# Altium project SDC.PrjPcb
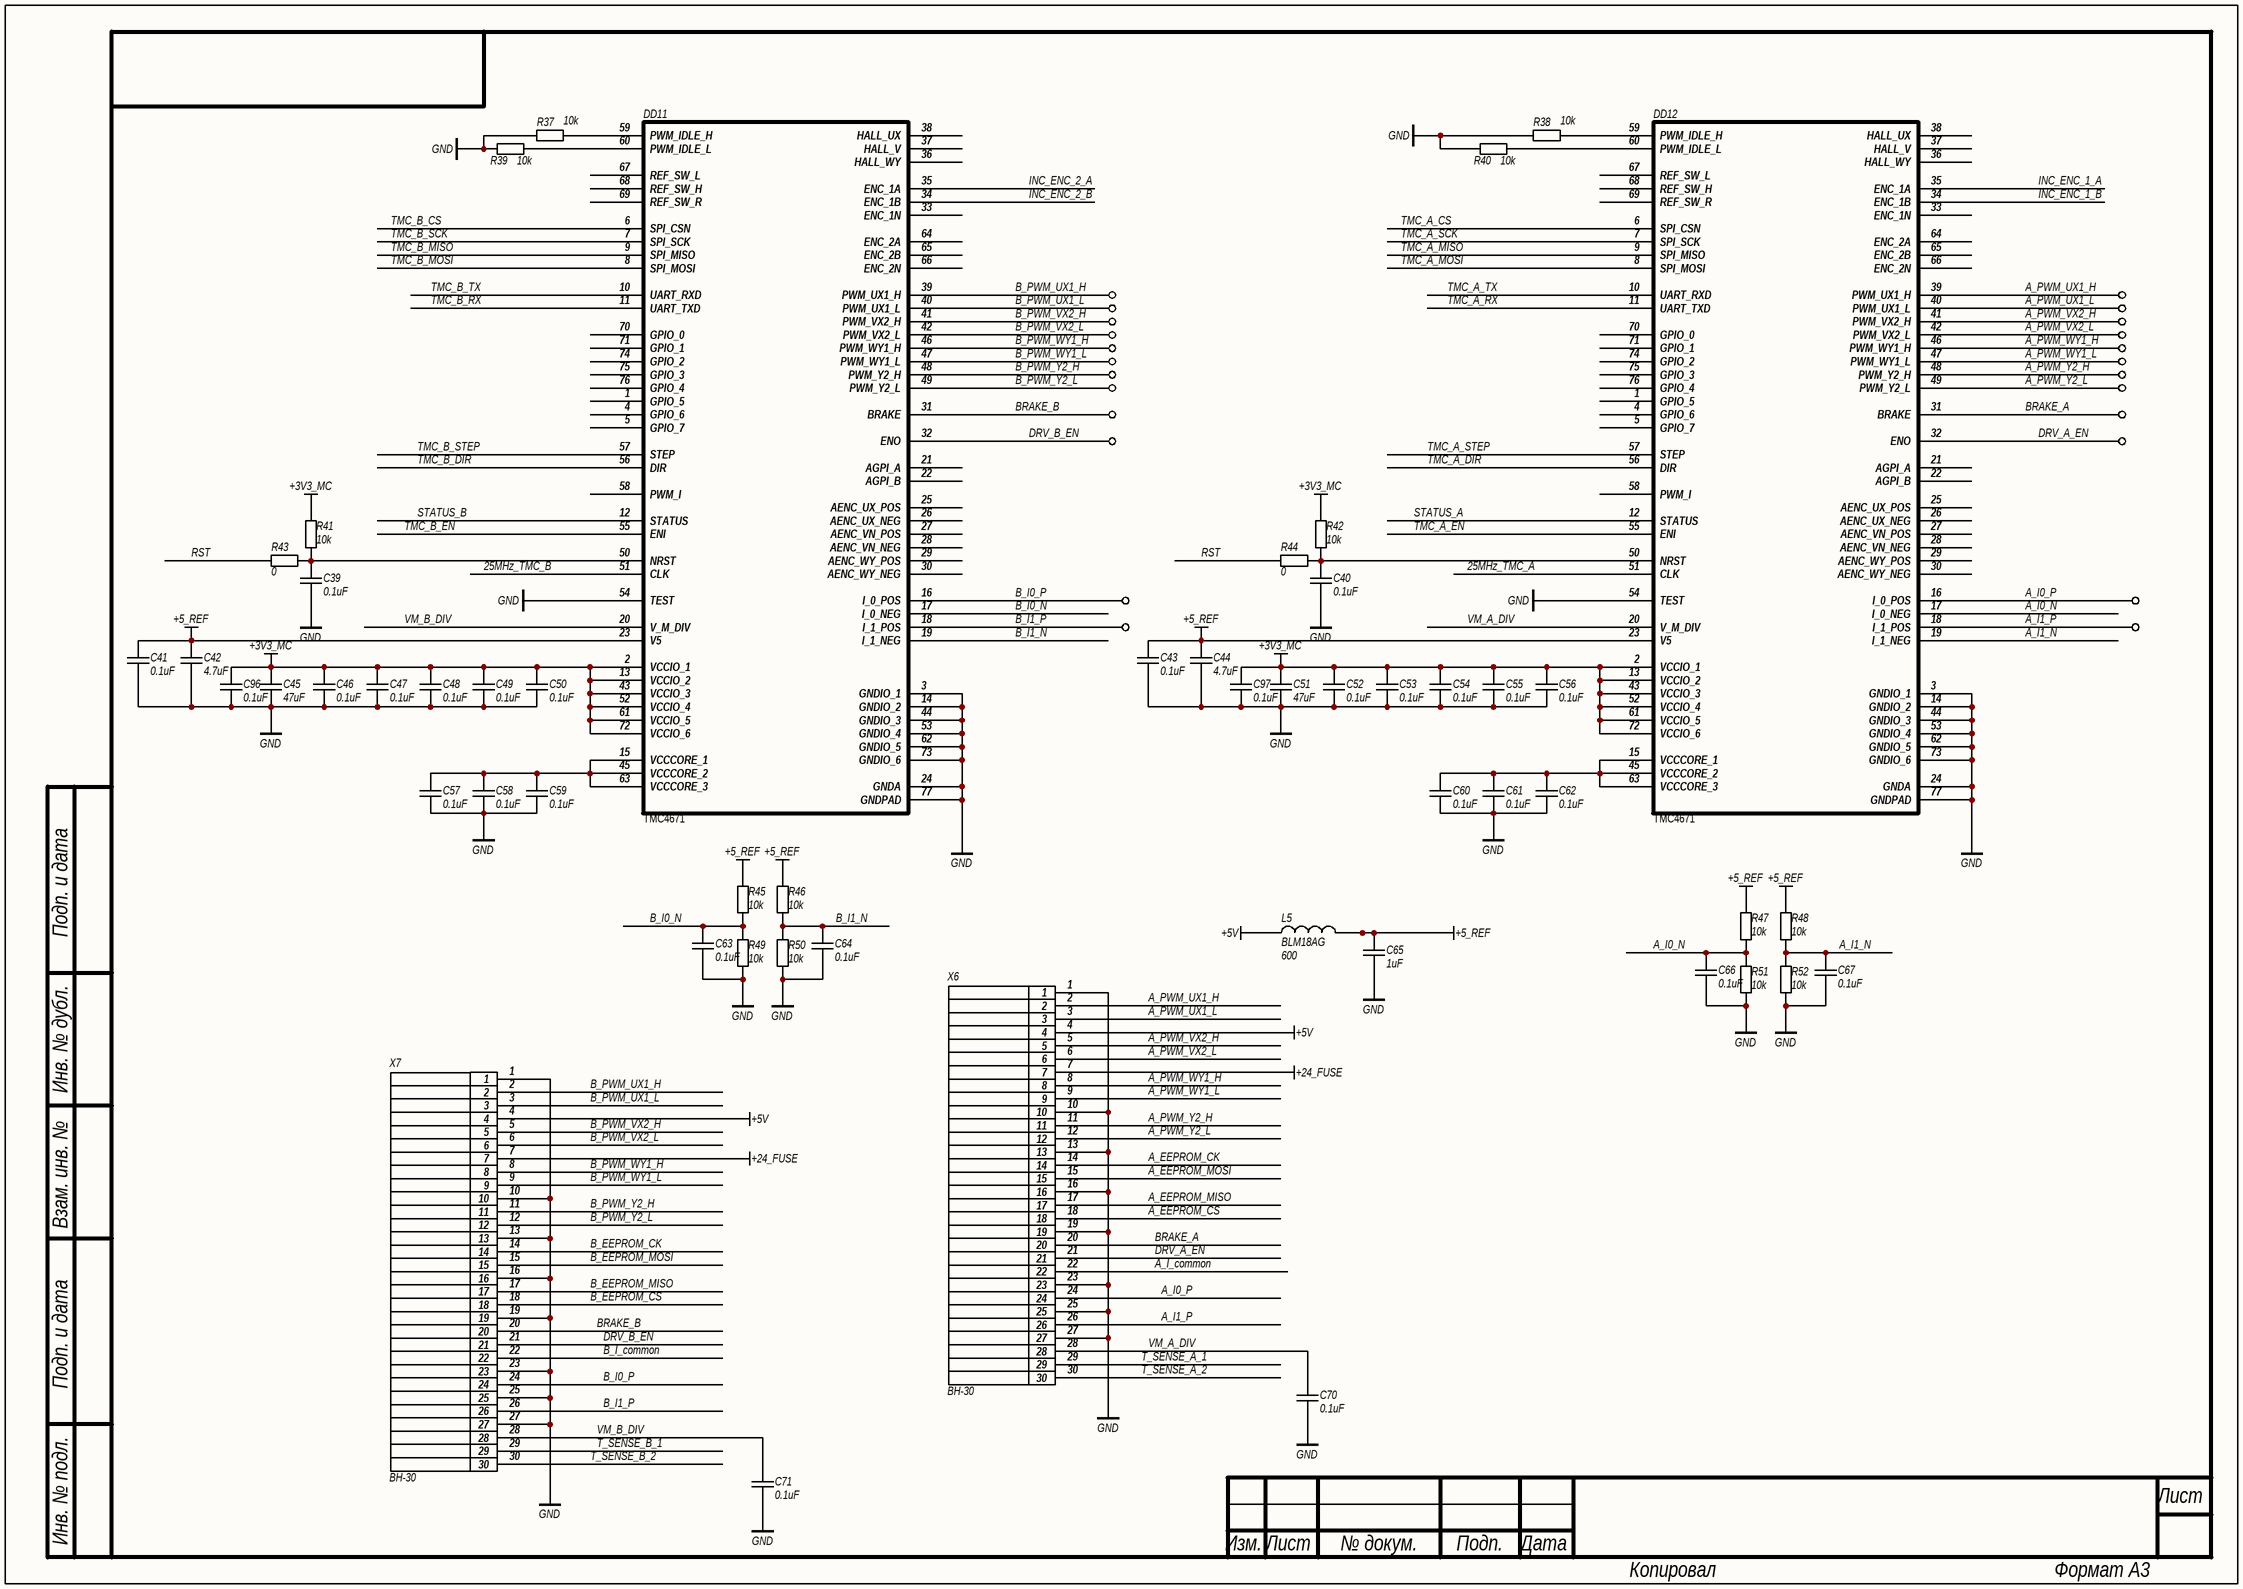
[diagram p0: SDC_3.SchDoc]
1 sheet, 78 parts. Net scope: global (net labels, ports and power ports of the same name join across sheets).
Board file: SDC.PcbDoc

## Sheet SDC_3.SchDoc
size 420 x 297 mm; PageSetup: Record=PageOptions|CenterHorizontal=False|CenterVertical=False|PrintScale=0.95|XCorrection=0.00|YCorrection=0.00|PrintKind=1|BorderSize=5000000|LeftOffset=0|BottomOffset=0|Orientation=1|PaperLength=1000|PaperWidth=1000|Scale=100|PaperSource=15|PrintQuality=600|MediaType=1|DitherType=10|PaperKind=A4|PrintScaleMode=1

### Parts
C39  value 0.1uF  [C0603]  (hidden comment: CAP)
C40  value 0.1uF  [C0603]  (hidden comment: CAP)
C41  value 0.1uF  [C0603]  (hidden comment: CAP)
C42  value 4.7uF  [C0603]  (hidden comment: CAP)
C43  value 0.1uF  [C0603]  (hidden comment: CAP)
C44  value 4.7uF  [C0603]  (hidden comment: CAP)
C45  value 47uF  [C1206]  (hidden comment: CAP)
C46  value 0.1uF  [C0603]  (hidden comment: CAP)
C47  value 0.1uF  [C0603]  (hidden comment: CAP)
C48  value 0.1uF  [C0603]  (hidden comment: CAP)
C49  value 0.1uF  [C0603]  (hidden comment: CAP)
C50  value 0.1uF  [C0603]  (hidden comment: CAP)
C51  value 47uF  [C1206]  (hidden comment: CAP)
C52  value 0.1uF  [C0603]  (hidden comment: CAP)
C53  value 0.1uF  [C0603]  (hidden comment: CAP)
C54  value 0.1uF  [C0603]  (hidden comment: CAP)
C55  value 0.1uF  [C0603]  (hidden comment: CAP)
C56  value 0.1uF  [C0603]  (hidden comment: CAP)
C57  value 0.1uF  [C0603]  (hidden comment: CAP)
C58  value 0.1uF  [C0603]  (hidden comment: CAP)
C59  value 0.1uF  [C0603]  (hidden comment: CAP)
C60  value 0.1uF  [C0603]  (hidden comment: CAP)
C61  value 0.1uF  [C0603]  (hidden comment: CAP)
C62  value 0.1uF  [C0603]  (hidden comment: CAP)
C63  value 0.1uF  [C0603]  (hidden comment: CAP)
C64  value 0.1uF  [C0603]  (hidden comment: CAP)
C65  value 1uF  [C0603]  (hidden comment: CAP)
C66  value 0.1uF  [C0603]  (hidden comment: CAP)
C67  value 0.1uF  [C0603]  (hidden comment: CAP)
C70  value 0.1uF  [C0603]  (hidden comment: CAP)
C71  value 0.1uF  [C0603]  (hidden comment: CAP)
C96  value 0.1uF  [C0603]  (hidden comment: CAP)
C97  value 0.1uF  [C0603]  (hidden comment: CAP)
DD11  TMC4671  [QFN76]
DD12  TMC4671  [QFN76]
L5  BLM18AG  value 600  [R0603]
R37  value 10k  [R0603]  (hidden comment: RES)
R38  value 10k  [R0603]  (hidden comment: RES)
R39  value 10k  [R0603]  (hidden comment: RES)
R40  value 10k  [R0603]  (hidden comment: RES)
R41  value 10k  [R0603]  (hidden comment: RES)
R42  value 10k  [R0603]  (hidden comment: RES)
R43  value 0  [R0603]  (hidden comment: RES)
R44  value 0  [R0603]  (hidden comment: RES)
R45  value 10k  [R0603]  (hidden comment: RES)
R46  value 10k  [R0603]  (hidden comment: RES)
R47  value 10k  [R0603]  (hidden comment: RES)
R48  value 10k  [R0603]  (hidden comment: RES)
R49  value 10k  [R0603]  (hidden comment: RES)
R50  value 10k  [R0603]  (hidden comment: RES)
R51  value 10k  [R0603]  (hidden comment: RES)
R52  value 10k  [R0603]  (hidden comment: RES)
TP1  Test_point  [TP1]  (value not drawn)
TP2  Test_point  [TP1]  (value not drawn)
TP3  Test_point  [TP1]  (value not drawn)
TP4  Test_point  [TP1]  (value not drawn)
TP5  Test_point  [TP1]  (value not drawn)
TP6  Test_point  [TP1]  (value not drawn)
TP7  Test_point  [TP1]  (value not drawn)
TP8  Test_point  [TP1]  (value not drawn)
TP9  Test_point  [TP1]  (value not drawn)
TP10  Test_point  [TP1]  (value not drawn)
TP11  Test_point  [TP1]  (value not drawn)
TP12  Test_point  [TP1]  (value not drawn)
TP13  Test_point  [TP1]  (value not drawn)
TP14  Test_point  [TP1]  (value not drawn)
TP15  Test_point  [TP1]  (value not drawn)
TP16  Test_point  [TP1]  (value not drawn)
TP17  Test_point  [TP1]  (value not drawn)
TP18  Test_point  [TP1]  (value not drawn)
TP19  Test_point  [TP1]  (value not drawn)
TP20  Test_point  [TP1]  (value not drawn)
TP21  Test_point  [TP1]  (value not drawn)
TP22  Test_point  [TP1]  (value not drawn)
TP23  Test_point  [TP1]  (value not drawn)
TP24  Test_point  [TP1]  (value not drawn)
X6  BH-30  [IDC-30(BH-30)]
X7  BH-30  [IDC-30(BH-30)]

### Nets
+3V3_MC: C45.2 C46.2 C47.2 C48.2 C49.2 C50.2 C51.2 C52.2 C53.2 C54.2 C55.2 C56.2 C96.2 C97.2 DD11.2(VCCIO_1) DD11.13(VCCIO_2) DD11.43(VCCIO_3) DD11.52(VCCIO_4) DD11.61(VCCIO_5) DD11.72(VCCIO_6) DD12.2(VCCIO_1) DD12.13(VCCIO_2) DD12.43(VCCIO_3) DD12.52(VCCIO_4) DD12.61(VCCIO_5) DD12.72(VCCIO_6) R41.2 R42.2
+5_REF: C41.2 C42.2 C43.2 C44.2 C65.2 DD11.23(V5) DD12.23(V5) L5.2 R45.2 R46.2 R47.2 R48.2
+5V: L5.1 X6.4 X7.4
+24_FUSE: X6.7 X7.7
GND: C39.1 C40.1 C41.1 C42.1 C43.1 C44.1 C45.1 C46.1 C47.1 C48.1 C49.1 C50.1 C51.1 C52.1 C53.1 C54.1 C55.1 C56.1 C57.1 C58.1 C59.1 C60.1 C61.1 C62.1 C63.1 C64.1 C65.1 C66.1 C67.1 C70.1 C71.1 C96.1 C97.1 DD11.3(GNDIO_1) DD11.14(GNDIO_2) DD11.24(GNDA) DD11.44(GNDIO_3) DD11.53(GNDIO_4) DD11.54(TEST) DD11.62(GNDIO_5) DD11.73(GNDIO_6) DD11.77(GNDPAD) DD12.3(GNDIO_1) DD12.14(GNDIO_2) DD12.24(GNDA) DD12.44(GNDIO_3) DD12.53(GNDIO_4) DD12.54(TEST) DD12.62(GNDIO_5) DD12.73(GNDIO_6) DD12.77(GNDPAD) R37.2 R38.2 R39.2 R40.2 R49.1 R50.1 R51.1 R52.1 X6.1 X6.10 X6.13 X6.16 X6.19 X6.23 X6.25 X6.27 X7.1 X7.10 X7.13 X7.16 X7.19 X7.23 X7.25 X7.27
25MHz_TMC_A: DD12.51(CLK)
25MHz_TMC_B: DD11.51(CLK)
A_EEPROM_CK: X6.14
A_EEPROM_CS: X6.18
A_EEPROM_MISO: X6.17
A_EEPROM_MOSI: X6.15
A_I0_N: C66.2 DD12.17(I_0_NEG) R47.1 R51.2
A_I0_P: DD12.16(I_0_POS) TP23.1 X6.24
A_I1_N: C67.2 DD12.19(I_1_NEG) R48.1 R52.2
A_I1_P: DD12.18(I_1_POS) TP24.1 X6.26
A_I_common: X6.22
A_PWM_UX1_H: DD12.39(PWM_UX1_H) TP2.1 X6.2
A_PWM_UX1_L: DD12.40(PWM_UX1_L) TP4.1 X6.3
A_PWM_VX2_H: DD12.41(PWM_VX2_H) TP6.1 X6.5
A_PWM_VX2_L: DD12.42(PWM_VX2_L) TP8.1 X6.6
A_PWM_WY1_H: DD12.46(PWM_WY1_H) TP10.1 X6.8
A_PWM_WY1_L: DD12.47(PWM_WY1_L) TP12.1 X6.9
A_PWM_Y2_H: DD12.48(PWM_Y2_H) TP14.1 X6.11
A_PWM_Y2_L: DD12.49(PWM_Y2_L) TP16.1 X6.12
B_EEPROM_CK: X7.14
B_EEPROM_CS: X7.18
B_EEPROM_MISO: X7.17
B_EEPROM_MOSI: X7.15
B_I0_N: C63.2 DD11.17(I_0_NEG) R45.1 R49.2
B_I0_P: DD11.16(I_0_POS) TP19.1 X7.24
B_I1_N: C64.2 DD11.19(I_1_NEG) R46.1 R50.2
B_I1_P: DD11.18(I_1_POS) TP20.1 X7.26
B_I_common: X7.22
B_PWM_UX1_H: DD11.39(PWM_UX1_H) TP1.1 X7.2
B_PWM_UX1_L: DD11.40(PWM_UX1_L) TP3.1 X7.3
B_PWM_VX2_H: DD11.41(PWM_VX2_H) TP5.1 X7.5
B_PWM_VX2_L: DD11.42(PWM_VX2_L) TP7.1 X7.6
B_PWM_WY1_H: DD11.46(PWM_WY1_H) TP9.1 X7.8
B_PWM_WY1_L: DD11.47(PWM_WY1_L) TP11.1 X7.9
B_PWM_Y2_H: DD11.48(PWM_Y2_H) TP13.1 X7.11
B_PWM_Y2_L: DD11.49(PWM_Y2_L) TP15.1 X7.12
BRAKE_A: DD12.31(BRAKE) TP22.1 X6.20
BRAKE_B: DD11.31(BRAKE) TP21.1 X7.20
DRV_A_EN: DD12.32(ENO) TP18.1 X6.21
DRV_B_EN: DD11.32(ENO) TP17.1 X7.21
INC_ENC_1_A: DD12.35(ENC_1A)
INC_ENC_1_B: DD12.34(ENC_1B)
INC_ENC_2_A: DD11.35(ENC_1A)
INC_ENC_2_B: DD11.34(ENC_1B)
RST: R43.2 R44.2
STATUS_A: DD12.12(STATUS)
STATUS_B: DD11.12(STATUS)
T_SENSE_A_1: X6.29
T_SENSE_A_2: X6.30
T_SENSE_B_1: X7.29
T_SENSE_B_2: X7.30
TMC_A_CS: DD12.6(SPI_CSN)
TMC_A_DIR: DD12.56(DIR)
TMC_A_EN: DD12.55(ENI)
TMC_A_MISO: DD12.9(SPI_MISO)
TMC_A_MOSI: DD12.8(SPI_MOSI)
TMC_A_RX: DD12.11(UART_TXD)
TMC_A_SCK: DD12.7(SPI_SCK)
TMC_A_STEP: DD12.57(STEP)
TMC_A_TX: DD12.10(UART_RXD)
TMC_B_CS: DD11.6(SPI_CSN)
TMC_B_DIR: DD11.56(DIR)
TMC_B_EN: DD11.55(ENI)
TMC_B_MISO: DD11.9(SPI_MISO)
TMC_B_MOSI: DD11.8(SPI_MOSI)
TMC_B_RX: DD11.11(UART_TXD)
TMC_B_SCK: DD11.7(SPI_SCK)
TMC_B_STEP: DD11.57(STEP)
TMC_B_TX: DD11.10(UART_RXD)
VM_A_DIV: C70.2 DD12.20(V_M_DIV) X6.28
VM_B_DIV: C71.2 DD11.20(V_M_DIV) X7.28
NetC39_2: C39.2 DD11.50(NRST) R41.1 R43.1
NetC40_2: C40.2 DD12.50(NRST) R42.1 R44.1
NetC57_2: C57.2 C58.2 C59.2 DD11.15(VCCCORE_1) DD11.45(VCCCORE_2) DD11.63(VCCCORE_3)
NetC60_2: C60.2 C61.2 C62.2 DD12.15(VCCCORE_1) DD12.45(VCCCORE_2) DD12.63(VCCCORE_3)
NetDD11_59: DD11.59(PWM_IDLE_H) R37.1
NetDD11_60: DD11.60(PWM_IDLE_L) R39.1
NetDD12_59: DD12.59(PWM_IDLE_H) R38.1
NetDD12_60: DD12.60(PWM_IDLE_L) R40.1

Not connected (* = marked no-connect by the designer): DD11 1(GPIO_5) 4(GPIO_6) 5(GPIO_7) 21(AGPI_A) 22(AGPI_B) 25(AENC_UX_POS) 26(AENC_UX_NEG) 27(AENC_VN_POS) 28(AENC_VN_NEG) 29(AENC_WY_POS) 30(AENC_WY_NEG) 33(ENC_1N) 36(HALL_WY) 37(HALL_V) 38(HALL_UX) 58(PWM_I) 64(ENC_2A) 65(ENC_2B) 66(ENC_2N) 67(REF_SW_L) 68(REF_SW_H) 69(REF_SW_R) 70(GPIO_0) 71(GPIO_1) 74(GPIO_2) 75(GPIO_3) 76(GPIO_4); DD12 1(GPIO_5) 4(GPIO_6) 5(GPIO_7) 21(AGPI_A) 22(AGPI_B) 25(AENC_UX_POS) 26(AENC_UX_NEG) 27(AENC_VN_POS) 28(AENC_VN_NEG) 29(AENC_WY_POS) 30(AENC_WY_NEG) 33(ENC_1N) 36(HALL_WY) 37(HALL_V) 38(HALL_UX) 58(PWM_I) 64(ENC_2A) 65(ENC_2B) 66(ENC_2N) 67(REF_SW_L) 68(REF_SW_H) 69(REF_SW_R) 70(GPIO_0) 71(GPIO_1) 74(GPIO_2) 75(GPIO_3) 76(GPIO_4)

### Notes on the sheet
- Подп. и дата
- Инв. № дубл.
- Взам. инв. №
- Инв. № подл.
- Лист
- Изм.
- № докум.
- Подп.
- Дата
- Копировал
- Формат А3

### Library data of the parts
C39-C44 C46-C50 C52-C67 C70 C71 C96 C97 = CAP: SMD Capacitor; Manufacturer: Murata; Material: X7R; Tolerance: 10%; Voltage: 50V; Type: Ceramic Capacitor
C45 C51 = CAP: SMD Capacitor; Manufacturer: Murata; Material: X7R; Tolerance: 10%; Voltage: 10V; Type: Ceramic Capacitor
DD11 DD12 = TMC4671: Motion_controller
R37-R52 = RES: SMD Resistor; Name: Chip SMD Resistor; Power: 0.062 Wt; Tolerance: 5%; Temperature Range: -55…155°C
TP1-TP24 = TP
X6 X7 = IDC15x2_GOST